# EAGLE design clock_arm_balanced (EAGLE 5.11)
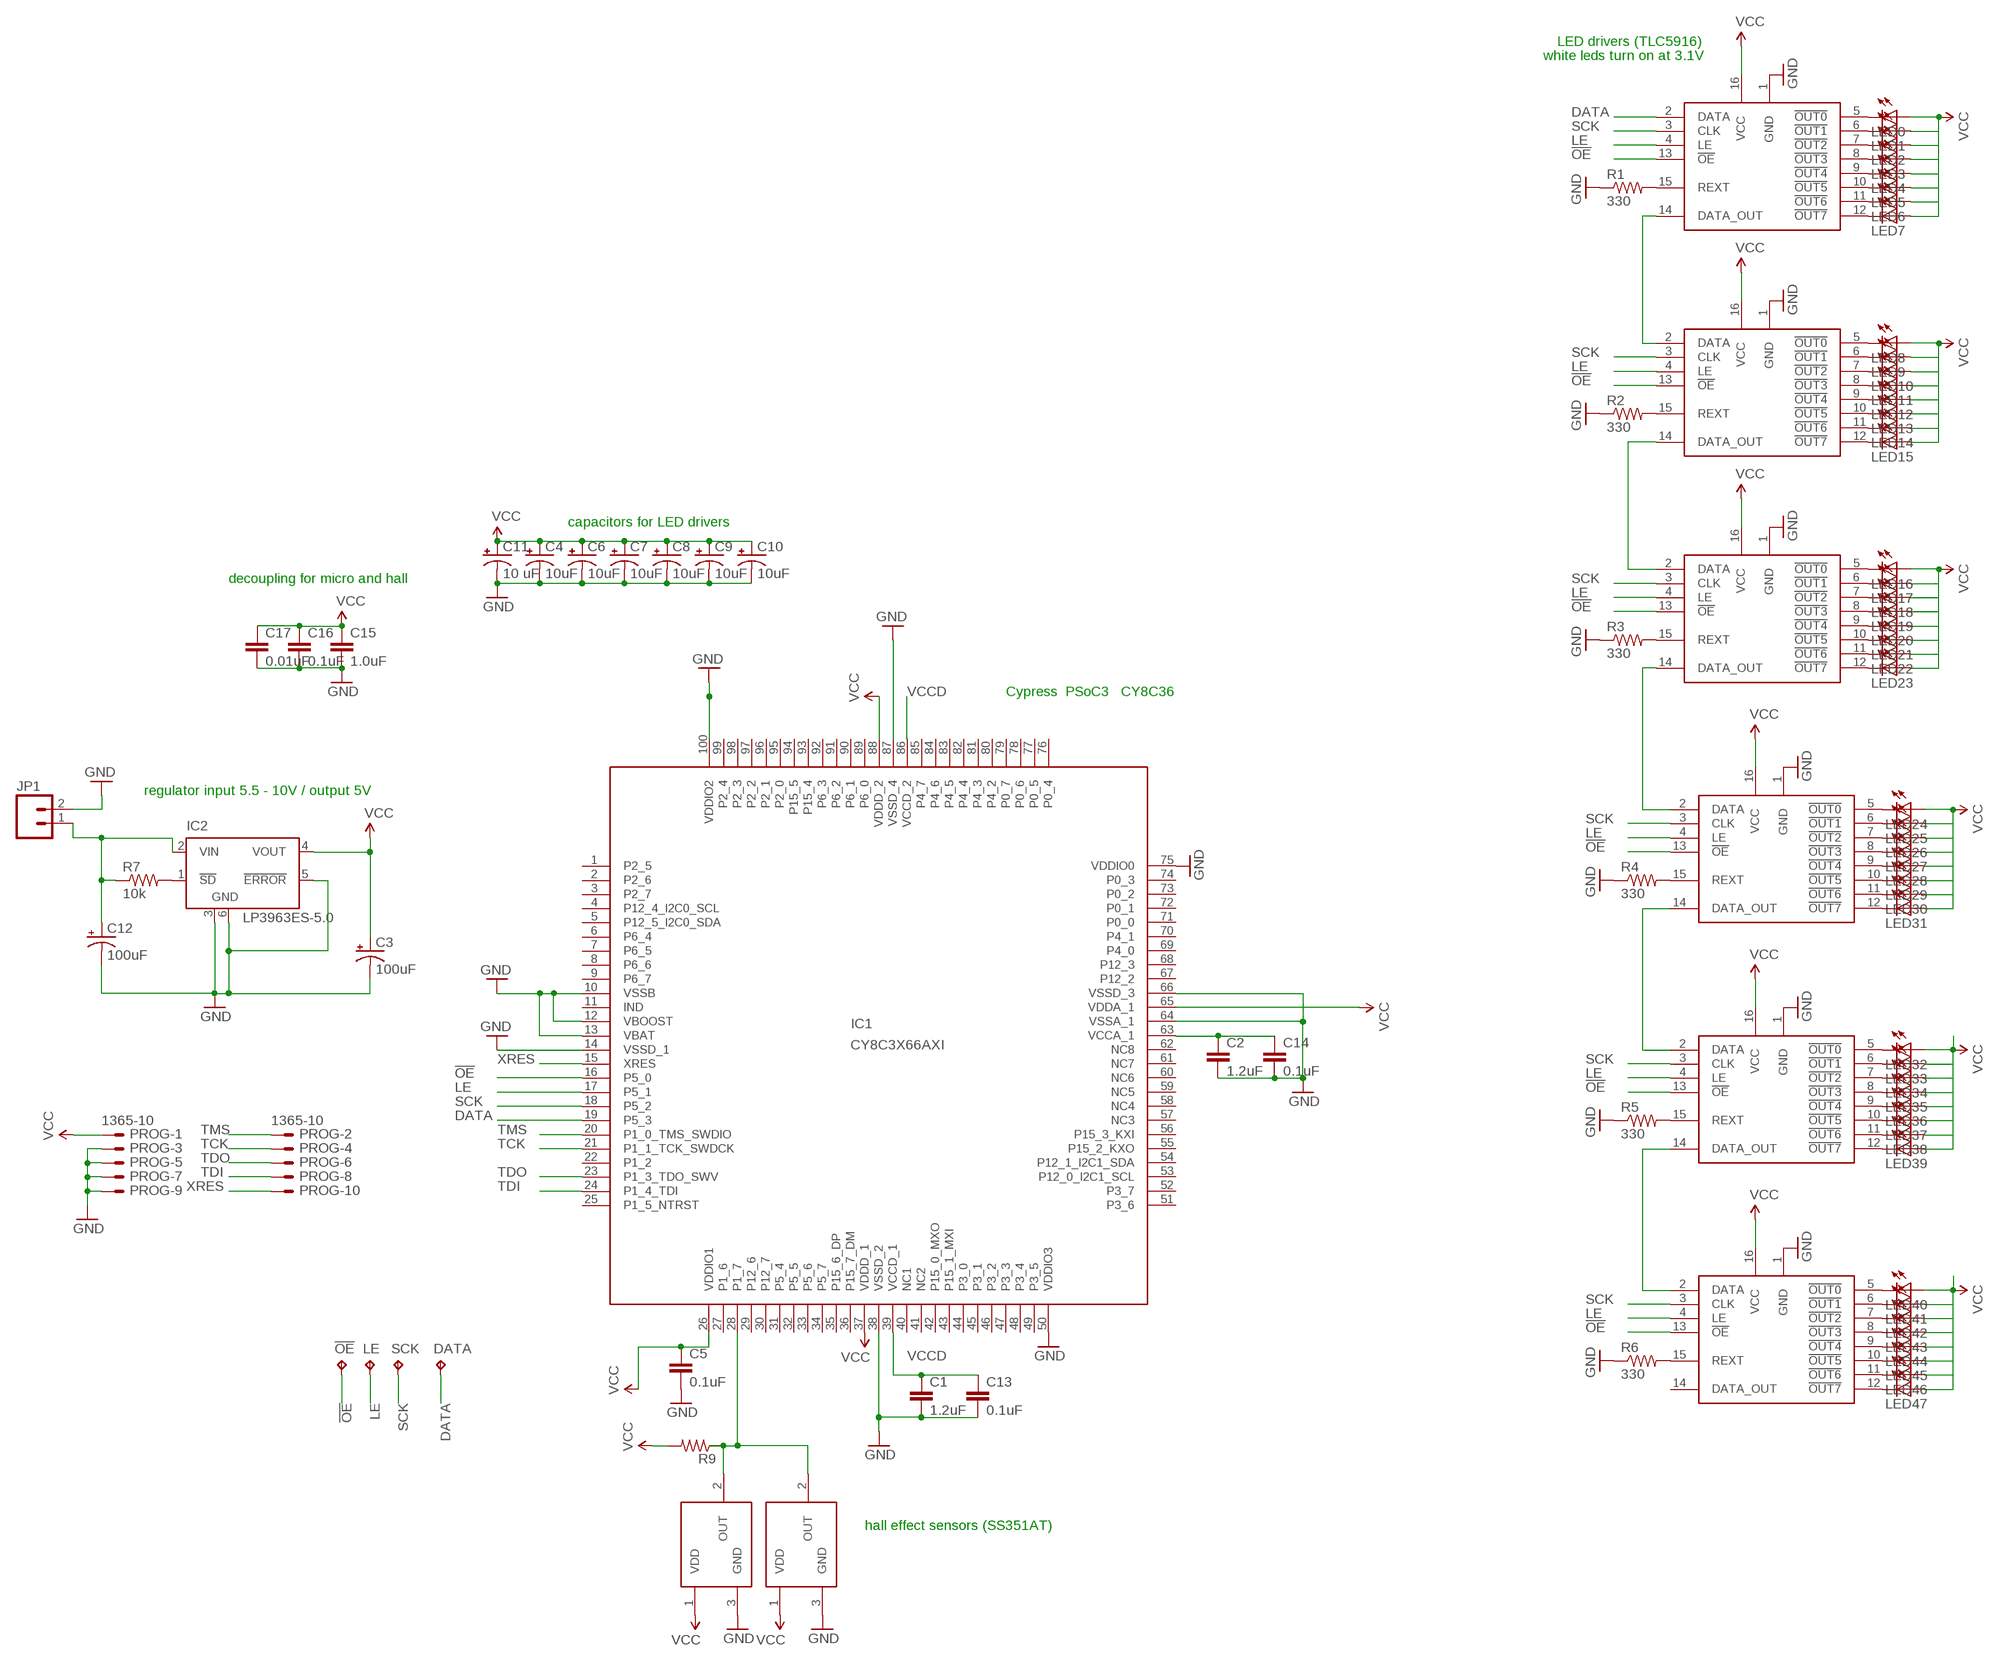
[diagram p0: schematic, sheet 1]

## Parts
!OE  TPTP12R  [TP12R]
C1  1.2uF  CAP0805  [0805]
C2  1.2uF  CAP0805  [0805]
C3  100uF  CAP_POL7343  [EIA7343]
C4  10uF  CAP_POL1206  [EIA3216]
C5  0.1uF  CAP0805  [0805]
C6  10uF  CAP_POL1206  [EIA3216]
C7  10uF  CAP_POL1206  [EIA3216]
C8  10uF  CAP_POL1206  [EIA3216]
C9  10uF  CAP_POL1206  [EIA3216]
C10  10uF  CAP_POL1206  [EIA3216]
C11  10 uF  CAP_POL1206  [EIA3216]
C12  100uF  CAP_POL7343  [EIA7343]
C13  0.1uF  CAP0805  [0805]
C14  0.1uF  CAP0805  [0805]
C15  1.0uF  CAP0805  [0805]
C16  0.1uF  CAP0805  [0805]
C17  0.01uF  CAP0805  [0805]
DATA  TPTP12R  [TP12R]
IC1  CY8C3X66AXI  [TQFP-100]
IC2  LP3963ES-5.0  [TO263-5]
JP1  M02PTH  [1X02]
LE  TPTP12R  [TP12R]
LED0  LG_T679-E1F1-1  [PLCC2]
LED1  LG_T679-E1F1-1  [PLCC2]
LED2  LG_T679-E1F1-1  [PLCC2]
LED3  LG_T679-E1F1-1  [PLCC2]
LED4  LG_T679-E1F1-1  [PLCC2]
LED5  LG_T679-E1F1-1  [PLCC2]
LED6  LG_T679-E1F1-1  [PLCC2]
LED7  LG_T679-E1F1-1  [PLCC2]
LED8  LG_T679-E1F1-1  [PLCC2]
LED9  LG_T679-E1F1-1  [PLCC2]
LED10  LG_T679-E1F1-1  [PLCC2]
LED11  LG_T679-E1F1-1  [PLCC2]
LED12  LG_T679-E1F1-1  [PLCC2]
LED13  LG_T679-E1F1-1  [PLCC2]
LED14  LG_T679-E1F1-1  [PLCC2]
LED15  LG_T679-E1F1-1  [PLCC2]
LED16  LG_T679-E1F1-1  [PLCC2]
LED17  LG_T679-E1F1-1  [PLCC2]
LED18  LG_T679-E1F1-1  [PLCC2]
LED19  LG_T679-E1F1-1  [PLCC2]
LED20  LG_T679-E1F1-1  [PLCC2]
LED21  LG_T679-E1F1-1  [PLCC2]
LED22  LG_T679-E1F1-1  [PLCC2]
LED23  LG_T679-E1F1-1  [PLCC2]
LED24  LG_T679-E1F1-1  [PLCC2]
LED25  LG_T679-E1F1-1  [PLCC2]
LED26  LG_T679-E1F1-1  [PLCC2]
LED27  LG_T679-E1F1-1  [PLCC2]
LED28  LG_T679-E1F1-1  [PLCC2]
LED29  LG_T679-E1F1-1  [PLCC2]
LED30  LG_T679-E1F1-1  [PLCC2]
LED31  LG_T679-E1F1-1  [PLCC2]
LED32  LG_T679-E1F1-1  [PLCC2]
LED33  LG_T679-E1F1-1  [PLCC2]
LED34  LG_T679-E1F1-1  [PLCC2]
LED35  LG_T679-E1F1-1  [PLCC2]
LED36  LG_T679-E1F1-1  [PLCC2]
LED37  LG_T679-E1F1-1  [PLCC2]
LED38  LG_T679-E1F1-1  [PLCC2]
LED39  LG_T679-E1F1-1  [PLCC2]
LED40  LG_T679-E1F1-1  [PLCC2]
LED41  LG_T679-E1F1-1  [PLCC2]
LED42  LG_T679-E1F1-1  [PLCC2]
LED43  LG_T679-E1F1-1  [PLCC2]
LED44  LG_T679-E1F1-1  [PLCC2]
LED45  LG_T679-E1F1-1  [PLCC2]
LED46  LG_T679-E1F1-1  [PLCC2]
LED47  LG_T679-E1F1-1  [PLCC2]
PROG  1365-10  [1365-10]
R1  330  RESISTOR0603-RES  [0603-RES]
R2  330  RESISTOR0603-RES  [0603-RES]
R3  330  RESISTOR0603-RES  [0603-RES]
R4  330  RESISTOR0603-RES  [0603-RES]
R5  330  RESISTOR0603-RES  [0603-RES]
R6  330  RESISTOR0603-RES  [0603-RES]
R7  10k  RESISTOR0603-RES  [0603-RES]
R9  RESISTOR0603-RES  [0603-RES]
SCK  TPTP12R  [TP12R]
U$1  TLC5916TSSOP  [TSSOP-16]
U$2  TLC5916TSSOP  [TSSOP-16]
U$3  TLC5916TSSOP  [TSSOP-16]
U$4  TLC5916TSSOP  [TSSOP-16]
U$5  TLC5916TSSOP  [TSSOP-16]
U$6  TLC5916TSSOP  [TSSOP-16]
U$7  SS351AT  [SOT23-3]
U$9  SS351AT  [SOT23-3]

## Nets
!OE: !OE.TP IC1.16(P5_0) U$1.13(!OE) U$2.13(!OE) U$3.13(!OE) U$4.13(!OE) U$5.13(!OE) U$6.13(!OE)
DATA: DATA.TP IC1.19(P5_3) U$1.2(DATA)
GND: C1.2 C2.2 C3.C(-) C4.C(-) C5.2 C6.C(-) C7.C(-) C8.C(-) C9.C(-) C10.C(-) C11.C(-) C12.C(-) C13.2 C14.2 C15.2 C16.2 C17.2 IC1.10(VSSB) IC1.12(VBOOST) IC1.13(VBAT) IC1.14(VSSD_1) IC1.38(VSSD_2) IC1.50(VDDIO3) IC1.64(VSSA_1) IC1.66(VSSD_3) IC1.75(VDDIO0) IC1.87(VSSD_4) IC1.100(VDDIO2) IC2.3(GND) IC2.5(!ERROR) IC2.6(GND) JP1.2 PROG.3 PROG.5 PROG.7 PROG.9 R1.1 R2.1 R3.1 R4.1 R5.1 R6.1 U$1.1(GND) U$2.1(GND) U$3.1(GND) U$4.1(GND) U$5.1(GND) U$6.1(GND) U$7.3(GND) U$9.3(GND)
LE: IC1.17(P5_1) LE.TP U$1.4(LE) U$2.4(LE) U$3.4(LE) U$4.4(LE) U$5.4(LE) U$6.4(LE)
N$1: LED0.C U$1.5(!OUT0)
N$2: LED1.C U$1.6(!OUT1)
N$3: LED2.C U$1.7(!OUT2)
N$4: LED3.C U$1.8(!OUT3)
N$5: LED4.C U$1.9(!OUT4)
N$6: LED5.C U$1.10(!OUT5)
N$7: LED6.C U$1.11(!OUT6)
N$8: LED7.C U$1.12(!OUT7)
N$9: R1.2 U$1.15(REXT)
N$10: LED8.C U$2.5(!OUT0)
N$11: LED9.C U$2.6(!OUT1)
N$12: LED10.C U$2.7(!OUT2)
N$13: LED11.C U$2.8(!OUT3)
N$14: LED12.C U$2.9(!OUT4)
N$15: LED13.C U$2.10(!OUT5)
N$16: LED14.C U$2.11(!OUT6)
N$17: LED15.C U$2.12(!OUT7)
N$18: R2.2 U$2.15(REXT)
N$19: LED16.C U$3.5(!OUT0)
N$20: LED17.C U$3.6(!OUT1)
N$21: LED18.C U$3.7(!OUT2)
N$22: LED19.C U$3.8(!OUT3)
N$23: LED20.C U$3.9(!OUT4)
N$24: LED21.C U$3.10(!OUT5)
N$25: LED22.C U$3.11(!OUT6)
N$26: LED23.C U$3.12(!OUT7)
N$27: R3.2 U$3.15(REXT)
N$28: LED24.C U$4.5(!OUT0)
N$29: LED25.C U$4.6(!OUT1)
N$30: LED26.C U$4.7(!OUT2)
N$31: LED27.C U$4.8(!OUT3)
N$32: LED28.C U$4.9(!OUT4)
N$33: LED29.C U$4.10(!OUT5)
N$34: LED30.C U$4.11(!OUT6)
N$35: LED31.C U$4.12(!OUT7)
N$36: R4.2 U$4.15(REXT)
N$37: U$1.14(DATA_OUT) U$2.2(DATA)
N$38: U$2.14(DATA_OUT) U$3.2(DATA)
N$39: U$3.14(DATA_OUT) U$4.2(DATA)
N$40: LED32.C U$5.5(!OUT0)
N$41: LED33.C U$5.6(!OUT1)
N$42: LED34.C U$5.7(!OUT2)
N$43: LED35.C U$5.8(!OUT3)
N$44: LED36.C U$5.9(!OUT4)
N$45: LED37.C U$5.10(!OUT5)
N$46: LED38.C U$5.11(!OUT6)
N$47: LED39.C U$5.12(!OUT7)
N$48: R5.2 U$5.15(REXT)
N$49: U$4.14(DATA_OUT) U$5.2(DATA)
N$50: LED40.C U$6.5(!OUT0)
N$51: LED41.C U$6.6(!OUT1)
N$52: LED42.C U$6.7(!OUT2)
N$53: LED43.C U$6.8(!OUT3)
N$54: LED44.C U$6.9(!OUT4)
N$55: LED45.C U$6.10(!OUT5)
N$56: LED46.C U$6.11(!OUT6)
N$57: LED47.C U$6.12(!OUT7)
N$58: R6.2 U$6.15(REXT)
N$59: U$5.14(DATA_OUT) U$6.2(DATA)
N$60: C12.A(+) IC2.2(VIN) JP1.1 R7.1
N$61: IC2.1(!SD) R7.2
N$80: C2.1 C14.1 IC1.63(VCCA_1)
N$81: IC1.28(P1_7) R9.1 U$7.2(OUT) U$9.2(OUT)
SCK: IC1.18(P5_2) SCK.TP U$1.3(CLK) U$2.3(CLK) U$3.3(CLK) U$4.3(CLK) U$5.3(CLK) U$6.3(CLK)
TCK: IC1.21(P1_1_TCK_SWDCK) PROG.4
TDI: IC1.24(P1_4_TDI) PROG.8
TDO: IC1.23(P1_3_TDO_SWV) PROG.6
TMS: IC1.20(P1_0_TMS_SWDIO) PROG.2
VCC: C3.A(+) C4.A(+) C5.1 C6.A(+) C7.A(+) C8.A(+) C9.A(+) C10.A(+) C11.A(+) C15.1 C16.1 C17.1 IC1.26(VDDIO1) IC1.37(VDDD_1) IC1.65(VDDA_1) IC1.88(VDDD_2) IC2.4(VOUT) LED0.A LED1.A LED2.A LED3.A LED4.A LED5.A LED6.A LED7.A LED8.A LED9.A LED10.A LED11.A LED12.A LED13.A LED14.A LED15.A LED16.A LED17.A LED18.A LED19.A LED20.A LED21.A LED22.A LED23.A LED24.A LED25.A LED26.A LED27.A LED28.A LED29.A LED30.A LED31.A LED32.A LED33.A LED34.A LED35.A LED36.A LED37.A LED38.A LED39.A LED40.A LED41.A LED42.A LED43.A LED44.A LED45.A LED46.A LED47.A PROG.1 R9.2 U$1.16(VCC) U$2.16(VCC) U$3.16(VCC) U$4.16(VCC) U$5.16(VCC) U$6.16(VCC) U$7.1(VDD) U$9.1(VDD)
VCCD: C1.1 C13.1 IC1.39(VCCD_1) IC1.86(VCCD_2)
XRES: IC1.15(XRES) PROG.10
Unconnected: IC1.1(P2_5) IC1.2(P2_6) IC1.3(P2_7) IC1.4(P12_4_I2C0_SCL) IC1.5(P12_5_I2C0_SDA) IC1.6(P6_4) IC1.7(P6_5) IC1.8(P6_6) IC1.9(P6_7) IC1.11(IND) IC1.22(P1_2) IC1.25(P1_5_NTRST) IC1.27(P1_6) IC1.29(P12_6) IC1.30(P12_7) IC1.31(P5_4) IC1.32(P5_5) IC1.33(P5_6) IC1.34(P5_7) IC1.35(P15_6_DP) IC1.36(P15_7_DM) IC1.40(NC1) IC1.41(NC2) IC1.42(P15_0_MXO) IC1.43(P15_1_MXI) IC1.44(P3_0) IC1.45(P3_1) IC1.46(P3_2) IC1.47(P3_3) IC1.48(P3_4) IC1.49(P3_5) IC1.51(P3_6) IC1.52(P3_7) IC1.53(P12_0_I2C1_SCL) IC1.54(P12_1_I2C1_SDA) IC1.55(P15_2_KXO) IC1.56(P15_3_KXI) IC1.57(NC3) IC1.58(NC4) IC1.59(NC5) IC1.60(NC6) IC1.61(NC7) IC1.62(NC8) IC1.67(P12_2) IC1.68(P12_3) IC1.69(P4_0) IC1.70(P4_1) IC1.71(P0_0) IC1.72(P0_1) IC1.73(P0_2) IC1.74(P0_3) IC1.76(P0_4) IC1.77(P0_5) IC1.78(P0_6) IC1.79(P0_7) IC1.80(P4_2) IC1.81(P4_3) IC1.82(P4_4) IC1.83(P4_5) IC1.84(P4_6) IC1.85(P4_7) IC1.89(P6_0) IC1.90(P6_1) IC1.91(P6_2) IC1.92(P6_3) IC1.93(P15_4) IC1.94(P15_5) IC1.95(P2_0) IC1.96(P2_1) IC1.97(P2_2) IC1.98(P2_3) IC1.99(P2_4) U$6.14(DATA_OUT)

## Notes on the sheet
- LED drivers (TLC5916)
- white leds turn on at 3.1V
- capacitors for LED drivers
- decoupling for micro and hall
- Cypress  PSoC3   CY8C36
- regulator input 5.5 - 10V / output 5V
- hall effect sensors (SS351AT)

## Library data of the parts
!OE DATA LE SCK = testpad:TP: Test pad
C1 C2 C5 C13-C17 = SparkFun:CAP: Capacitor Standard 0603 ceramic capacitor, and 0.1" leaded capacitor.
C3 C4 C6-C12 = SparkFun:CAP_POL: Capacitor Polarized These are standard SMD and PTH capacitors. Normally 10uF, 47uF, and 100uF in electrolytic and tantalum varieties. Always verify the external diameter of the through hole cap, it varies with capacity, voltage, and manufacturer. The EIA devices should be standard.
IC1 = PSoC3:CY8C3X66AXI: CY8C_pins edit this description Auto generated by make-symbol-device-package-bsdl.ulp Rev. 34 Source: CY8C_pins.txt
IC2 = linear:LP3963?*: 3A Fast Ultra Low Dropout Linear Regulator Source: http://cache.national.com/ds/LP/LP3963.pdf
JP1 = SparkFun:M02: Header 2 Standard 2-pin 0.1" header. Use with straight break away headers (SKU : PRT-00116), right angle break away headers (PRT-00553), swiss pins (PRT-00743), machine pins (PRT-00117), and female headers (PRT-00115). Molex polarized connector foot print use with SKU : PRT-08233 with associated crimp pins and housings.
LED0 LED1-LED47 = led:*_T679-?-1: LC TOPLED® Low Current LED Source: http://catalog.osram-os.com .. LG_LS_LY_T679_OBS.pdf; COLOR: green
PROG = con-leotronics:1365-10: DUAL ROW STRAIGHT HEADER 1364 SERIES. 1.27mm x 1.27mm. Without Fixing Post. SMT Source: http://www.leotronics.co.uk/Conexcon/Data%20Sheets/sec.%20A/1364ing.pdf; OC_FARNELL: unknown; OC_NEWARK: unknown
R1-R7 R9 = SparkFun:RESISTOR: Resistor Basic schematic elements and footprints for 0603, 1206, and PTH resistors.
U$1-U$6 = SparkFun:TLC5916
U$7 U$9 = SparkFun:SS351AT

## Board
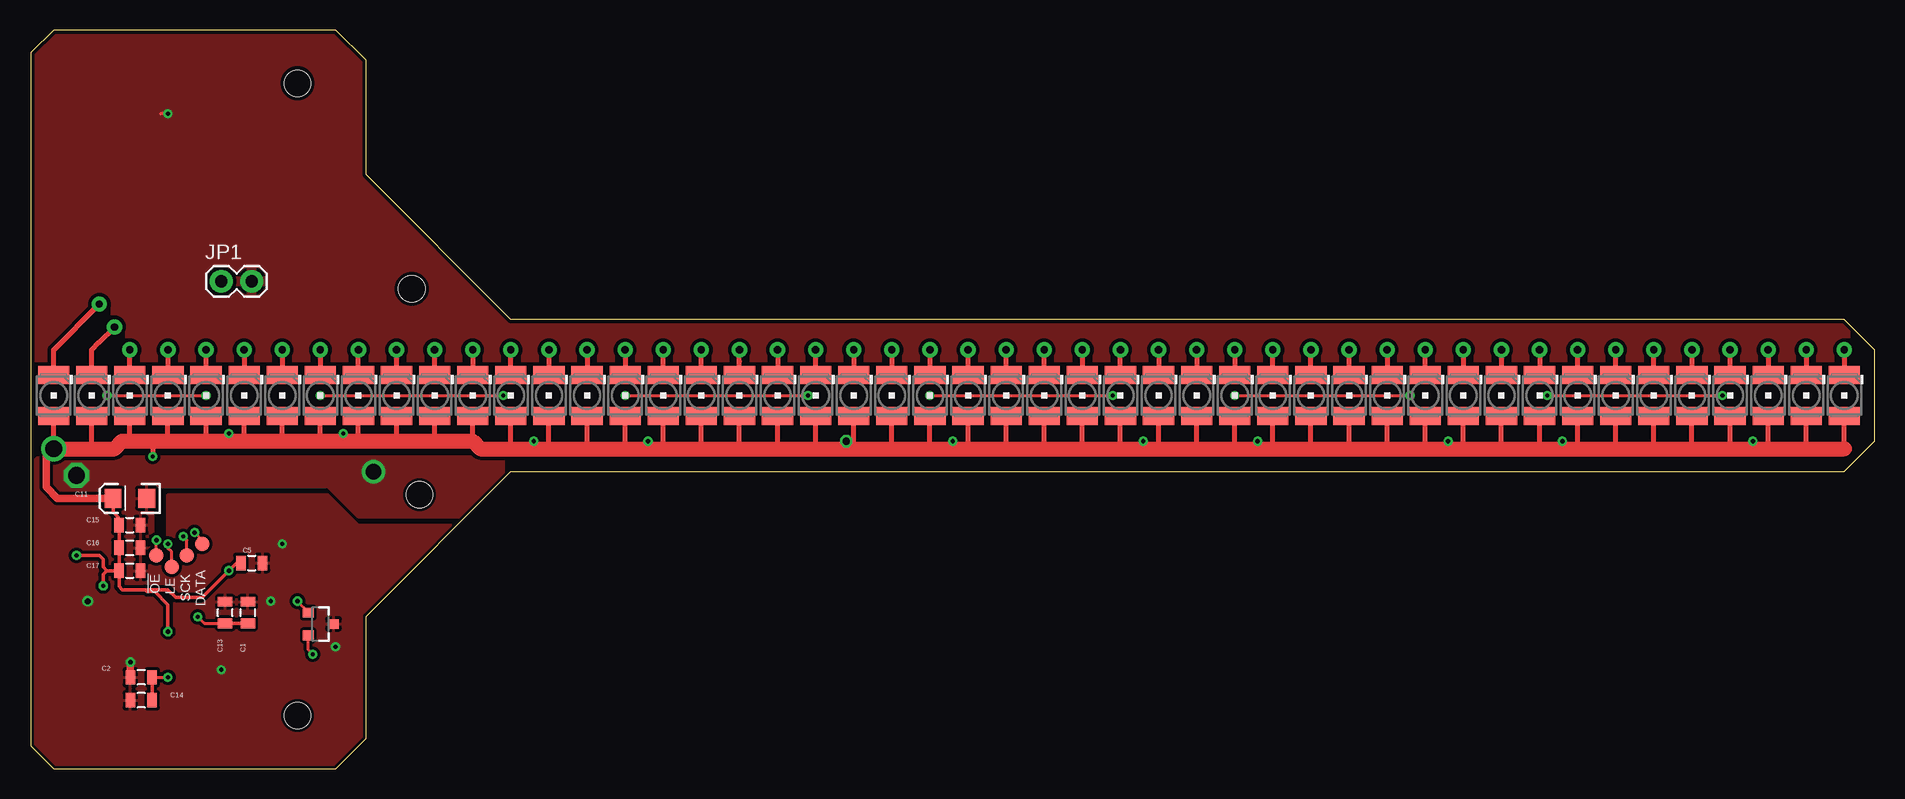
[diagram p1: board, top side]
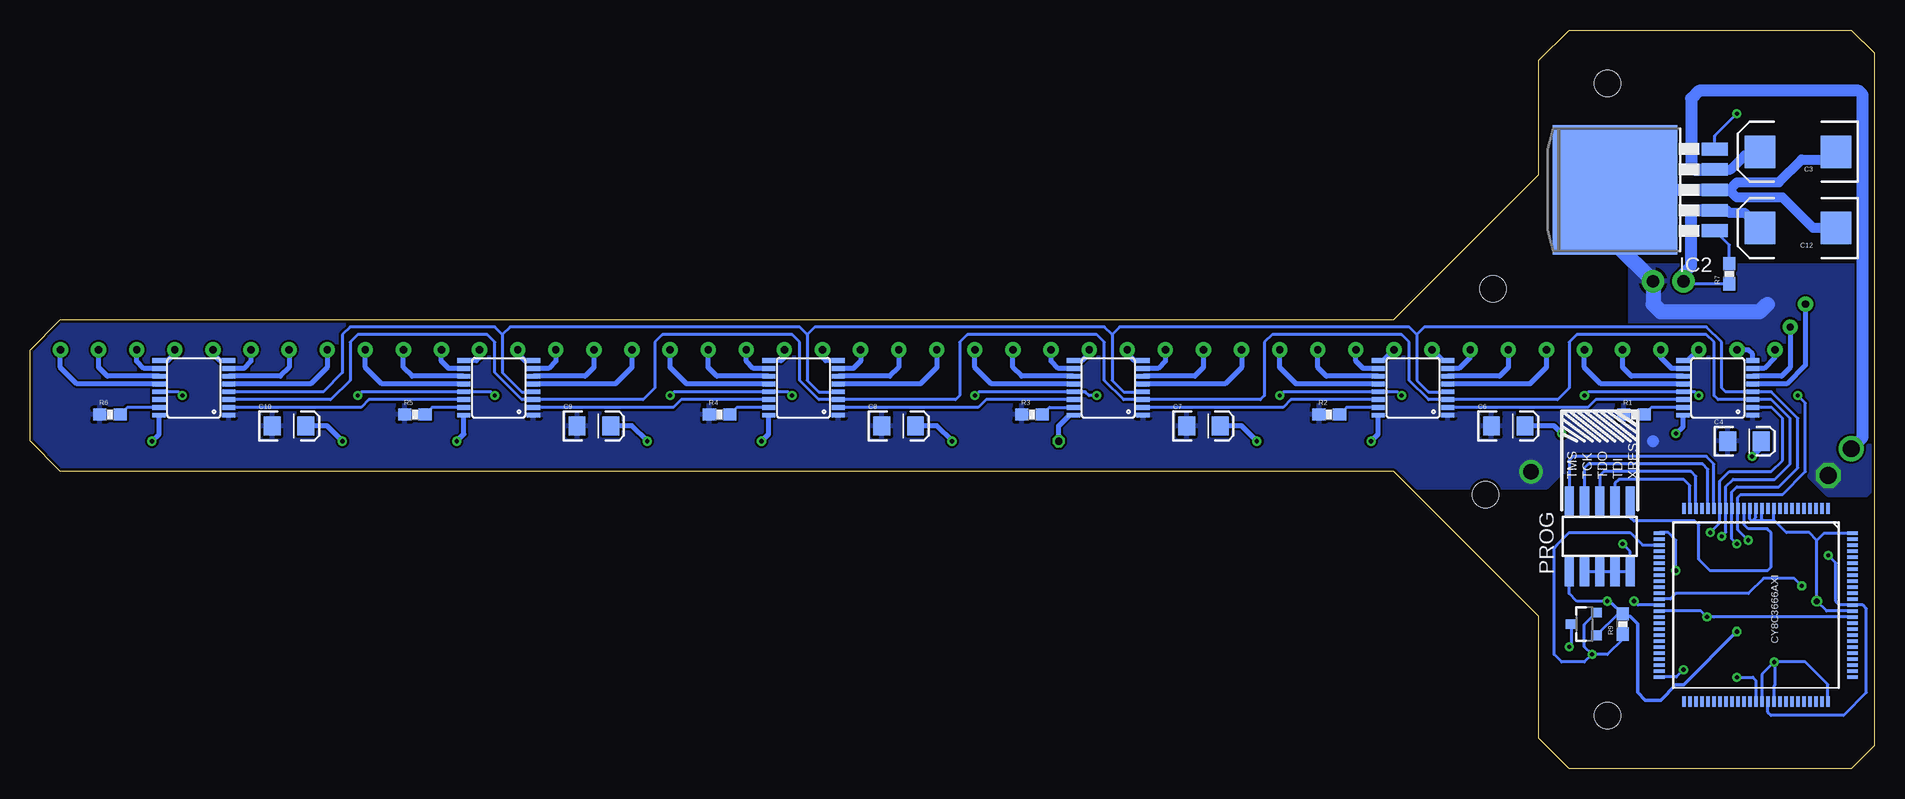
[diagram p2: board, bottom side, seen from below]

Size 153.67 x 61.59 mm. Coordinates in mm from the lower left corner, seen from the top.
Outline: 0,1.9 1.9,0 25.4,0 27.94,2.54 27.94,12.7 40.01,24.76 151.13,24.76 153.67,27.3 153.67,34.92 151.14,37.45 151.11,37.45 40.01,37.46 27.94,49.53 27.94,59.05 25.4,61.59 1.9,61.59 0,59.69 0,1.9
Copper layers (1*16): Top 0.0356mm / dielectric 1.5011mm / Bottom 0.0356mm
Design rules "SilverCircuits *": minimum track width 7mil, minimum drill 14mil, track to track 7mil, track to pad 7mil, pad to pad 7mil, via to via 7mil, smd to smd 0mil, copper to edge 10mil, drill to drill 8mil, minimum pad ring 10mil, minimum via ring 8mil, stop-mask expansion 4mil, vias tented up to drill 0mil, thermal gap 10mil
Holes 2.2 mm at 22.23,57.15 22.23,4.44 31.75,40 32.38,22.86

### Footprints (pad centres in the part's own frame; a part is rotated, then mirrored left to right if it is on the bottom)
TP12R = smd 1.2 x 1.2: TP 0,0
0805 = smd 0.8 x 1.2: 1 -0.9,0; 2 0.9,0
EIA7343 = smd 2.55 x 2.7: A 3.17,0; C -3.17,0
EIA3216 = smd 1.4 x 1.6: A 1.4,0; C -1.4,0
TQFP-100 = smd 0.9 x 0.3: 1 -8.05,6; 2 -8.05,5.5; 3 -8.05,5; 4 -8.05,4.5; 5 -8.05,4; 6 -8.05,3.5; 7 -8.05,3; 8 -8.05,2.5; 9 -8.05,2; 10 -8.05,1.5; 11 -8.05,1; 12 -8.05,0.5; 13 -8.05,0; 14 -8.05,-0.5; 15 -8.05,-1; 16 -8.05,-1.5; 17 -8.05,-2; 18 -8.05,-2.5; 19 -8.05,-3; 20 -8.05,-3.5; 21 -8.05,-4; 22 -8.05,-4.5; 23 -8.05,-5; 24 -8.05,-5.5; 25 -8.05,-6; 51 8.05,-6; 52 8.05,-5.5; 53 8.05,-5; 54 8.05,-4.5; 55 8.05,-4; 56 8.05,-3.5; 57 8.05,-3; 58 8.05,-2.5; 59 8.05,-2; 60 8.05,-1.5; 61 8.05,-1; 62 8.05,-0.5; 63 8.05,0; 64 8.05,0.5; 65 8.05,1; 66 8.05,1.5; 67 8.05,2; 68 8.05,2.5; 69 8.05,3; 70 8.05,3.5; 71 8.05,4; 72 8.05,4.5; 73 8.05,5; 74 8.05,5.5; 75 8.05,6 | smd 0.3 x 0.9: 26 -6,-8.05; 27 -5.5,-8.05; 28 -5,-8.05; 29 -4.5,-8.05; 30 -4,-8.05; 31 -3.5,-8.05; 32 -3,-8.05; 33 -2.5,-8.05; 34 -2,-8.05; 35 -1.5,-8.05; 36 -1,-8.05; 37 -0.5,-8.05; 38 0,-8.05; 39 0.5,-8.05; 40 1,-8.05; 41 1.5,-8.05; 42 2,-8.05; 43 2.5,-8.05; 44 3,-8.05; 45 3.5,-8.05; 46 4,-8.05; 47 4.5,-8.05; 48 5,-8.05; 49 5.5,-8.05; 50 6,-8.05; 76 6,8.05; 77 5.5,8.05; 78 5,8.05; 79 4.5,8.05; 80 4,8.05; 81 3.5,8.05; 82 3,8.05; 83 2.5,8.05; 84 2,8.05; 85 1.5,8.05; 86 1,8.05; 87 0.5,8.05; 88 0,8.05; 89 -0.5,8.05; 90 -1,8.05; 91 -1.5,8.05; 92 -2,8.05; 93 -2.5,8.05; 94 -3,8.05; 95 -3.5,8.05; 96 -4,8.05; 97 -4.5,8.05; 98 -5,8.05; 99 -5.5,8.05; 100 -6,8.05
TO263-5 = smd 1.067 x 2.159: 1 -3.404,-5.791; 2 -1.702,-5.791; 3 0,-5.791; 4 1.702,-5.791; 5 3.404,-5.791 | smd 10.8 x 10.41: 6 0,2.54
1X02 = drill 1.016 pad 1.88 round: 1 0,0; 2 2.54,0
PLCC2 = smd 2.6 x 1.5: A 0,1.7; C 0,-1.7
1365-10 = smd 0.76 x 2.4: 1 -2.54,-2.95; 2 -2.54,2.95; 3 -1.27,-2.95; 4 -1.27,2.95; 5 0,-2.95; 6 0,2.95; 7 1.27,-2.95; 8 1.27,2.95; 9 2.54,-2.95; 10 2.54,2.95
0603-RES = smd 1.1 x 1: 1 -0.85,0; 2 0.85,0
TSSOP-16 = smd 0.4 x 1.1: 1 -2.275,-2.9; 2 -1.625,-2.9; 3 -0.975,-2.9; 4 -0.325,-2.9; 5 0.325,-2.9; 6 0.975,-2.9; 7 1.625,-2.9; 8 2.275,-2.9; 9 2.275,2.9; 10 1.625,2.9; 11 0.975,2.9; 12 0.325,2.9; 13 -0.325,2.9; 14 -0.975,2.9; 15 -1.625,2.9; 16 -2.275,2.9
SOT23-3 = smd 0.8 x 0.9: 1 -0.95,-1; 2 0.95,-1; 3 0,1.1

### Placement (x,y rotation side)
!OE  10.48,17.78 180 top
C1  16.19,13.02 90 top
C2  9.21,7.62 180 top
C3  6.35,51.44 180 bottom
C4  10.8,27.3 0 bottom
C5  18.41,17.14 0 top
C6  30.48,28.57 0 bottom
C7  55.88,28.57 0 bottom
C8  81.28,28.57 0 bottom
C9  106.68,28.57 0 bottom
C10  132.08,28.57 0 bottom
C11  8.26,22.54 180 top
C12  6.35,45.08 180 bottom
C13  18.1,13.02 90 top
C14  9.21,5.71 180 top
C15  8.26,20.32 0 top
C16  8.26,18.41 0 top
C17  8.26,16.51 0 top
DATA  14.29,18.73 180 top
IC1  9.84,13.65 270 bottom
IC2  19.05,48.26 90 bottom
JP1  15.88,40.64 0 top
LE  11.75,16.83 180 top
LED0  1.9,31.11 180 top
LED1  5.08,31.11 180 top
LED2  8.26,31.11 180 top
LED3  11.43,31.11 180 top
LED4  14.6,31.11 180 top
LED5  17.78,31.11 180 top
LED6  20.95,31.11 180 top
LED7  24.13,31.11 180 top
LED8  27.3,31.11 180 top
LED9  30.48,31.11 180 top
LED10  33.66,31.11 180 top
LED11  36.83,31.11 180 top
LED12  40.01,31.11 180 top
LED13  43.18,31.11 180 top
LED14  46.35,31.11 180 top
LED15  49.53,31.11 180 top
LED16  52.71,31.11 180 top
LED17  55.88,31.11 180 top
LED18  59.05,31.11 180 top
LED19  62.23,31.11 180 top
LED20  65.41,31.11 180 top
LED21  68.58,31.11 180 top
LED22  71.75,31.11 180 top
LED23  74.93,31.11 180 top
LED24  78.1,31.11 180 top
LED25  81.28,31.11 180 top
LED26  84.46,31.11 180 top
LED27  87.63,31.11 180 top
LED28  90.81,31.11 180 top
LED29  93.98,31.11 180 top
LED30  97.16,31.11 180 top
LED31  100.33,31.11 180 top
LED32  103.5,31.11 180 top
LED33  106.68,31.11 180 top
LED34  109.85,31.11 180 top
LED35  113.03,31.11 180 top
LED36  116.2,31.11 180 top
LED37  119.38,31.11 180 top
LED38  122.55,31.11 180 top
LED39  125.73,31.11 180 top
LED40  128.91,31.11 180 top
LED41  132.08,31.11 180 top
LED42  135.25,31.11 180 top
LED43  138.43,31.11 180 top
LED44  141.6,31.11 180 top
LED45  144.78,31.11 180 top
LED46  147.95,31.11 180 top
LED47  151.13,31.11 180 top
PROG  22.86,19.37 0 bottom
R1  20,29.53 0 bottom
R2  45.4,29.53 0 bottom
R3  70.17,29.53 0 bottom
R4  96.2,29.53 0 bottom
R5  121.6,29.53 0 bottom
R6  147,29.53 0 bottom
R7  12.06,41.27 90 bottom
R9  20.95,12.06 90 bottom
SCK  13.02,17.78 180 top
U$1  13.02,31.75 90 bottom
U$2  38.42,31.75 90 bottom
U$3  63.82,31.75 90 bottom
U$4  89.22,31.75 90 bottom
U$5  114.62,31.75 90 bottom
U$6  140.02,31.75 90 bottom
U$7  24.13,12.06 270 top
U$9  24.13,12.06 90 bottom

### Tracks (layer width: path | path; a pad name or v marks a point on that pad's centre or on a via)
!OE  (via drill 0.36)
  Top 0.254: v24.13,31.11 v39.37,31.11 | v49.53,31.11 v64.77,31.11 | v6.35,31.11 v14.6,31.11 | v74.93,31.11 v90.17,31.11 | v100.33,31.11 v114.94,31.11 | v126.36,31.11 v140.97,31.11 | !OE.TP v10.48,19.05
  Bottom 0.254: v24.13,31.11 23.8,31.42 U$1.13 14.93,31.42 v14.6,31.11 | v39.37,31.11 39.7,31.42 U$2.13 49.21,31.42 v49.53,31.11 | v64.77,31.11 65.41,31.11 65.73,31.42 U$3.13 74.6,31.42 v74.93,31.11 | v6.35,31.11 5.71,30.48 5.71,24.76 7.62,22.86 11.11,22.86 11.34,22.63 IC1.16 11.34,19.91 v10.48,19.05 | v90.17,31.11 90.5,31.42 U$4.13 100,31.42 v100.33,31.11 | v114.94,31.11 115.26,31.42 U$5.13 126.04,31.42 v126.36,31.11 | U$6.13 141.29,31.42 v140.97,31.11
DATA  (via drill 0.36)
  Top 0.254: v13.65,19.68 14.29,19.05 DATA.TP
  Bottom 0.254: U$1.2 8.53,30.12 7.62,29.21 7.62,25.72 8.57,24.76 12.06,24.76 12.84,23.99 IC1.19 12.84,20.49 v13.65,19.68
GND  (via drill 0.36, 0.5, 1.3, 1.4)
  Top 0.254: v11.43,54.61 10.8,54.61
  Top 0.61: v8.31,8.89 C2.2
  Bottom 0.254: v8.31,8.89 8.26,8.84 8.26,6.98 8.34,6.9 IC1.66 | IC1.100 4.16,19.65 4.76,19.05 | IC1.87 3.95,13.15 v4.76,13.97 4.76,19.05 | IC1.64 9.34,7.85 v8.31,8.89 | IC1.75 3.84,7.02 5.71,8.89 v8.31,8.89 | IC1.50 16.48,7.65 v15.88,8.25 | U$7.3 25.23,10.33 v25.4,10.16 | PROG.3 PROG.5 PROG.7 PROG.9 20.32,18.1 v20.95,18.73 | 8.34,20.72 IC1.10 | 8.34,20.72 7.3,19.68 5.4,19.68 4.76,19.05 | IC1.14 10.34,20.82 10.16,20.64 | 9.52,20.64 8.43,20.64 8.34,20.72 | 9.52,20.64 10.16,20.64 | IC1.12 9.34,20.82 9.52,20.64 | IC1.13 9.84,20.95 10.16,20.64 | IC2.5 13.26,52.78 v11.43,54.61 | IC1.38 19.69,13.65 v20,13.97
  Bottom 0.813: 12.06,48.26 IC2.3 | 12.06,48.26 11.43,48.89 7.94,48.89 6.03,50.8 3.81,50.8 C3.C | C12.C 5.08,45.08 7.62,47.62 11.43,47.62 12.06,48.26
  Bottom 1.016: 18.41,27.3 18.42,27.3 | IC2.3 IC2.6 21.59,43.81
  Bottom 1.27: 21.59,43.81 JP1.2 18.41,38.73 17.78,38.1 9.52,38.1 8.89,38.73
  other vias: 28.57,24.76 3.81,24.45
  pour Bottom: 0,23.49 0,41.91 20.32,41.91 20.32,36.83 153.35,37.15 153.67,36.83 153.67,25.4 153.35,24.76 39.37,24.76 38.1,23.49 27.3,23.49 26.03,24.76 5.71,24.76 3.81,22.86 0.63,22.86
  pour Top (isolate 0.305): 0,33.66 0,59.69 1.9,61.59 25.4,61.59 27.94,59.05 27.94,49.53 40.01,37.46 153.67,37.46 153.67,33.66
  pour Top (isolate 0.254): 0,0 0,25.4 0.63,26.03 39.37,26.03 39.37,24.13 36.2,20.95 27.3,20.95 24.77,23.49 10.16,23.49 10.16,19.05 11.43,19.05 11.43,22.86 24.77,22.86 27.3,20.32 35.56,20.32 27.94,12.7 27.94,2.54 25.4,0
LE  (via drill 0.36)
  Top 0.254: v11.43,18.73 11.43,18.41 11.75,18.1 LE.TP
  Bottom 0.254: U$2.4 37.14,31.42 38.1,32.38 38.1,36.2 | 38.1,36.2 38.73,36.83 62.87,36.83 63.5,36.2 | U$3.4 62.54,31.42 63.5,32.38 63.5,36.2 | 63.5,36.2 64.13,36.83 88.26,36.83 88.9,36.2 | U$4.4 87.94,31.42 88.9,32.38 88.9,36.2 | 88.9,36.2 89.53,36.83 113.66,36.83 114.3,36.2 | U$5.4 112.7,31.42 114.3,33.02 114.3,36.2 | 114.3,36.2 114.94,36.83 127,36.83 127.63,36.2 127.63,33.02 129.23,31.42 U$6.4 | 38.1,36.2 37.46,36.83 13.97,36.83 12.7,35.56 12.7,31.75 12.38,31.42 U$1.4 8.56,31.42 6.35,29.21 6.35,25.08 7.94,23.49 11.43,23.49 11.84,23.08 IC1.17 11.84,19.14 v11.43,18.73
N$1  (via drill 0.61 pad 1.27)
  Top 0.406: LED0.C 1.9,34.92 v5.71,38.73
  Bottom 0.406: v5.71,38.73 5.71,33.66 7.3,32.07 U$1.5
N$2  (via drill 0.61 pad 1.27)
  Top 0.406: LED1.C 5.08,34.92 5.71,35.56 v6.98,36.83
  Bottom 0.406: U$1.6 7.71,32.73 6.98,33.45 v6.98,36.83
N$3  (via drill 0.61 pad 1.27)
  Top 0.406: LED2.C v8.26,34.92
  Bottom 0.406: U$1.7 9.17,33.38 8.26,34.29 v8.26,34.92
N$4  (via drill 0.61 pad 1.27)
  Top 0.406: v11.43,34.92 LED3.C
  Bottom 0.406: U$1.8 10.12,34.56 10.48,34.92 v11.43,34.92
N$5  (via drill 0.61 pad 1.27)
  Top 0.406: LED4.C v14.6,34.92
  Bottom 0.406: U$1.9 15.51,34.02 v14.6,34.92
N$6  (via drill 0.61 pad 1.27)
  Top 0.406: v17.78,34.92 LED5.C
  Bottom 0.406: U$1.10 16.87,33.38 17.78,34.29 v17.78,34.92
N$7  (via drill 0.61 pad 1.27)
  Top 0.406: v20.95,34.92 LED6.C
  Bottom 0.406: U$1.11 20.23,32.73 20.95,33.45 v20.95,34.92
N$8  (via drill 0.61 pad 1.27)
  Top 0.406: v24.13,34.92 LED7.C
  Bottom 0.406: U$1.12 22.76,32.07 24.13,33.45 v24.13,34.92
N$9
  Bottom 0.254: U$1.15 18.55,30.12 R1.2
N$10  (via drill 0.61 pad 1.27)
  Top 0.406: LED8.C v27.3,34.92
  Bottom 0.406: U$2.5 28.68,32.07 27.3,33.45 v27.3,34.92
N$11  (via drill 0.61 pad 1.27)
  Top 0.406: LED9.C v30.48,34.92
  Bottom 0.406: U$2.6 31.2,32.73 30.48,33.45 v30.48,34.92
N$12  (via drill 0.61 pad 1.27)
  Top 0.406: LED10.C v33.66,34.92
  Bottom 0.406: U$2.7 34.57,33.38 33.66,34.29 v33.66,34.92
N$13  (via drill 0.61 pad 1.27)
  Top 0.406: v36.83,34.92 LED11.C
  Bottom 0.406: U$2.8 35.93,34.02 v36.83,34.92
N$14  (via drill 0.61 pad 1.27)
  Top 0.406: LED12.C v40.01,34.92
  Bottom 0.406: U$2.9 40.9,34.02 v40.01,34.92
N$15  (via drill 0.61 pad 1.27)
  Top 0.406: v43.18,34.92 LED13.C
  Bottom 0.406: U$2.10 42.58,33.38 43.18,33.97 v43.18,34.92
N$16  (via drill 0.61 pad 1.27)
  Top 0.406: v46.35,34.92 LED14.C
  Bottom 0.406: U$2.11 45.63,32.73 46.35,33.45 v46.35,34.92
N$17  (via drill 0.61 pad 1.27)
  Top 0.406: v49.53,34.92 LED15.C
  Bottom 0.406: U$2.12 48.15,32.07 49.53,33.45 v49.53,34.92
N$18
  Bottom 0.254: U$2.15 43.96,30.12 R2.2
N$19  (via drill 0.61 pad 1.27)
  Top 0.406: LED16.C v52.71,34.92
  Bottom 0.406: U$3.5 54.08,32.07 52.71,33.45 v52.71,34.92
N$20  (via drill 0.61 pad 1.27)
  Top 0.406: LED17.C v55.88,34.92
  Bottom 0.406: U$3.6 56.6,32.73 55.88,33.45 v55.88,34.92
N$21  (via drill 0.61 pad 1.27)
  Top 0.406: 59.05,33.97 LED18.C v59.05,34.92
  Bottom 0.406: U$3.7 59.65,33.38 59.05,33.97 v59.05,34.92
N$22  (via drill 0.61 pad 1.27)
  Top 0.406: v62.23,34.92 LED19.C
  Bottom 0.406: U$3.8 61.65,34.02 62.23,34.61 v62.23,34.92
N$23  (via drill 0.61 pad 1.27)
  Top 0.406: LED20.C v65.41,34.92
  Bottom 0.406: U$3.9 65.99,34.02 65.41,34.61 v65.41,34.92
N$24  (via drill 0.61 pad 1.27)
  Top 0.406: v68.58,34.92 LED21.C
  Bottom 0.406: U$3.10 67.98,33.38 68.58,33.97 v68.58,34.92
N$25  (via drill 0.61 pad 1.27)
  Top 0.406: v71.75,34.92 LED22.C
  Bottom 0.406: U$3.11 71.03,32.73 71.75,33.45 v71.75,34.92
N$26  (via drill 0.61 pad 1.27)
  Top 0.406: v74.93,34.92 LED23.C
  Bottom 0.406: U$3.12 73.56,32.07 74.93,33.45 v74.93,34.92
N$27
  Bottom 0.254: U$3.15 68.72,30.12 R3.2
N$28  (via drill 0.61 pad 1.27)
  Top 0.406: LED24.C v78.1,34.92
  Bottom 0.406: U$4.5 79.48,32.07 78.1,33.45 v78.1,34.92
N$29  (via drill 0.61 pad 1.27)
  Top 0.406: LED25.C v81.28,34.92
  Bottom 0.406: U$4.6 82,32.73 81.28,33.45 v81.28,34.92
N$30  (via drill 0.61 pad 1.27)
  Top 0.406: LED26.C v84.46,34.92
  Bottom 0.406: U$4.7 85.05,33.38 84.46,33.97 v84.46,34.92
N$31  (via drill 0.61 pad 1.27)
  Top 0.406: v87.63,34.92 LED27.C
  Bottom 0.406: U$4.8 87.37,34.02 87.63,34.29 v87.63,34.92
N$32  (via drill 0.61 pad 1.27)
  Top 0.406: LED28.C v90.81,34.92
  Bottom 0.406: U$4.9 91.07,34.02 90.81,34.29 v90.81,34.92
N$33  (via drill 0.61 pad 1.27)
  Top 0.406: v93.98,34.92 LED29.C
  Bottom 0.406: U$4.10 93.38,33.38 93.98,33.97 v93.98,34.92
N$34  (via drill 0.61 pad 1.27)
  Top 0.406: v97.16,34.92 LED30.C
  Bottom 0.406: U$4.11 96.43,32.73 97.16,33.45 v97.16,34.92
N$35  (via drill 0.61 pad 1.27)
  Top 0.406: v100.33,34.92 LED31.C
  Bottom 0.406: U$4.12 98.95,32.07 100.33,33.45 v100.33,34.92
N$36
  Bottom 0.254: U$4.15 94.75,30.12 R4.2
N$37
  Bottom 0.254: U$1.14 23.2,30.77 23.85,30.12 U$2.2
N$38
  Bottom 0.254: U$2.14 48.6,30.77 49.25,30.12 U$3.2
N$39
  Bottom 0.254: U$3.14 74,30.77 74.65,30.12 U$4.2
N$40  (via drill 0.61 pad 1.27)
  Top 0.406: LED32.C v103.5,34.92
  Bottom 0.406: U$5.5 104.88,32.07 103.5,33.45 v103.5,34.92
N$41  (via drill 0.61 pad 1.27)
  Top 0.406: LED33.C v106.68,34.92
  Bottom 0.406: U$5.6 107.41,32.73 106.68,33.45 v106.68,34.92
N$42  (via drill 0.61 pad 1.27)
  Top 0.406: LED34.C v109.85,34.92
  Bottom 0.406: U$5.7 110.45,33.38 109.85,33.97 v109.85,34.92
N$43  (via drill 0.61 pad 1.27)
  Top 0.406: v113.03,34.92 LED35.C
  Bottom 0.406: U$5.8 112.45,34.02 113.03,34.61 v113.03,34.92
N$44  (via drill 0.61 pad 1.27)
  Top 0.406: LED36.C v116.2,34.92
  Bottom 0.406: U$5.9 116.47,34.02 116.2,34.29 v116.2,34.92
N$45  (via drill 0.61 pad 1.27)
  Top 0.406: v119.38,34.92 LED37.C
  Bottom 0.406: U$5.10 118.78,33.38 119.38,33.97 v119.38,34.92
N$46  (via drill 0.61 pad 1.27)
  Top 0.406: v122.55,34.92 LED38.C
  Bottom 0.406: U$5.11 121.83,32.73 122.55,33.45 v122.55,34.92
N$47  (via drill 0.61 pad 1.27)
  Top 0.406: v125.73,34.92 LED39.C
  Bottom 0.406: U$5.12 124.35,32.07 125.73,33.45 v125.73,34.92
N$48
  Bottom 0.254: U$5.15 120.16,30.12 R5.2
N$49
  Bottom 0.254: U$4.14 99.4,30.77 100.05,30.12 U$5.2
N$50  (via drill 0.61 pad 1.27)
  Top 0.406: LED40.C v128.91,34.92
  Bottom 0.406: U$6.5 130.28,32.07 128.91,33.45 v128.91,34.92
N$51  (via drill 0.61 pad 1.27)
  Top 0.406: LED41.C v132.08,34.92
  Bottom 0.406: U$6.6 132.8,32.73 132.08,33.45 v132.08,34.92
N$52  (via drill 0.61 pad 1.27)
  Top 0.406: LED42.C v135.25,34.92
  Bottom 0.406: U$6.7 135.85,33.38 135.25,33.97 v135.25,34.92
N$53  (via drill 0.61 pad 1.27)
  Top 0.406: v138.43,34.92 LED43.C
  Bottom 0.406: U$6.8 137.85,34.02 138.43,34.61 v138.43,34.92
N$54  (via drill 0.61 pad 1.27)
  Top 0.406: LED44.C v141.6,34.92
  Bottom 0.406: U$6.9 142.19,34.02 141.6,34.61 v141.6,34.92
N$55  (via drill 0.61 pad 1.27)
  Top 0.406: v144.78,34.92 LED45.C
  Bottom 0.406: U$6.10 144.18,33.38 144.78,33.97 v144.78,34.92
N$56  (via drill 0.61 pad 1.27)
  Top 0.406: v147.95,34.92 LED46.C
  Bottom 0.406: U$6.11 147.23,32.73 147.95,33.45 v147.95,34.92
N$57  (via drill 0.61 pad 1.27)
  Top 0.406: v151.13,34.92 LED47.C
  Bottom 0.406: U$6.12 149.75,32.07 151.13,33.45 v151.13,34.92
N$58
  Bottom 0.254: U$6.15 145.55,30.12 R6.2
N$59
  Bottom 0.254: U$5.14 125.44,30.77 126.08,30.12 U$6.2
N$60
  Bottom 0.254: 15.45,40.42 JP1.1 15.66,40.42 R7.1
  Bottom 0.813: IC2.2 12.27,46.56 12.06,46.35 10.79,46.35 C12.A
  Bottom 1.016: IC2.2 15.04,46.56 15.24,46.35 15.24,41.91 15.88,41.27 JP1.1
N$61
  Bottom 0.254: R7.2 12.06,43.66 IC2.1
N$80  (via drill 0.36)
  Top 0.254: C2.1 v11.43,7.62
  Top 0.305: C14.1 C2.1
  Bottom 0.254: v11.43,7.62 C2.1 9.84,7.35 IC1.63
N$81  (via drill 0.36)
  Top 0.254: U$7.2 23.13,9.89 v23.49,9.52
  Bottom 0.254: R9.1 20.95,10.79 22.23,9.52 v23.49,9.52 | v23.49,9.52 24.13,10.16 24.13,12.01 U$9.2 | IC1.28 19.29,18.65 20.32,19.68 25.4,19.68 26.43,18.65 26.67,18.41 26.67,9.52 26.03,8.89 24.13,8.89 v23.49,9.52
SCK  (via drill 0.36)
  Top 0.254: v12.7,19.37 13.02,19.05 SCK.TP
  Bottom 0.254: U$6.3 128.61,30.77 127,32.38 127,35.56 126.36,36.2 115.57,36.2 114.94,35.56 114.94,33.02 112.69,30.77 U$5.3 102.57,30.77 101.6,31.75 101.6,35.56 100.97,36.2 90.17,36.2 89.53,35.56 89.53,32.38 87.93,30.77 U$4.3 76.54,30.77 76.2,31.11 76.2,35.56 75.56,36.2 64.77,36.2 64.13,35.56 64.13,32.38 62.52,30.77 U$3.3 51.14,30.77 50.8,31.11 50.8,35.56 50.16,36.2 39.37,36.2 38.73,35.56 38.73,32.38 37.12,30.77 U$2.3 26.38,30.77 25.4,31.75 25.4,35.56 24.77,36.2 13.97,36.2 13.34,35.56 13.34,31.11 12.99,30.77 U$1.3 8.55,30.77 6.98,29.21 6.98,25.4 8.26,24.13 11.75,24.13 12.34,23.53 IC1.18 12.34,19.72 v12.7,19.37
TCK
  Bottom 0.254: IC1.21 13.84,24.95 14.29,25.4 23.81,25.4 24.13,25.08 PROG.4
TDI
  Bottom 0.254: IC1.24 15.34,23.6 15.88,24.13 21.27,24.13 21.59,23.81 PROG.8
TDO
  Bottom 0.254: IC1.23 14.84,24.37 15.24,24.76 22.54,24.76 22.86,24.45 PROG.6
TMS
  Bottom 0.254: IC1.20 13.34,25.41 13.97,26.03 25.08,26.03 25.4,25.72 PROG.2
VCC  (via drill 0.36, 0.6, 1.4)
  Top 0.254: U$7.1 23.13,13.06 v22.23,13.97
  Top 0.305: C11.A 6.85,21.4 7.3,20.95 7.3,20.37 C15.1 | C15.1 C16.1 C17.1 | v3.81,17.78 5.71,17.78 6.03,17.46 6.03,16.83 6.35,16.51 | C17.1 7.35,15.19 7.62,14.92 9.52,14.92 | C17.1 C15.1 | 9.52,14.92 11.43,14.92 12.06,14.29 14.29,14.29 v16.51,16.51 17.14,17.14 C5.1 | 11.43,13.65 v11.43,11.43 | 11.43,13.65 | 6.35,16.51 C17.1 | v6.03,15.24 6.03,16.19 6.35,16.51 | 11.43,13.65 10.32,14.76 9.68,14.76 9.52,14.92
  Top 0.406: v1.9,26.67 LED0.A | 5.08,26.67 LED1.A | 8.26,27.3 LED2.A | 11.43,27.3 LED3.A | 14.6,27.3 LED4.A | 17.78,27.3 LED5.A | 20.95,27.3 LED6.A | 24.13,27.3 LED7.A | 27.3,27.3 LED8.A | 30.48,27.3 LED9.A | 33.66,27.3 LED10.A | 36.83,27.3 LED11.A | 40.01,26.67 LED12.A | 43.18,26.67 LED13.A | 46.35,26.67 LED14.A | 49.53,26.67 LED15.A | 52.71,26.67 LED16.A | 55.88,26.67 LED17.A | 59.05,26.67 LED18.A | 62.23,26.67 LED19.A | 65.41,26.67 LED20.A | 68.58,26.67 68.58,27.3 | 68.58,27.3 LED21.A | 71.75,26.67 LED22.A | 74.93,26.67 LED23.A | 78.1,26.67 LED24.A | 81.28,26.67 LED25.A | 84.46,26.67 LED26.A | 87.63,26.67 LED27.A | 90.81,26.67 LED28.A | 93.98,26.67 LED29.A | 97.16,26.67 LED30.A | 100.33,26.67 LED31.A | 103.5,26.67 LED32.A | 106.68,26.67 LED33.A | 109.85,26.67 LED34.A | 113.03,26.67 LED35.A | 116.2,26.67 LED36.A | 119.38,26.67 LED37.A | 122.55,26.67 LED38.A | 125.73,26.67 LED39.A | 128.91,26.67 LED40.A | 132.08,26.67 LED41.A | 135.25,26.67 LED42.A | 138.43,26.67 LED43.A | 141.6,26.67 LED44.A | 144.78,26.67 LED45.A | 147.95,26.67 LED46.A | 151.13,26.67 LED47.A | v10.16,26.03 10.16,26.99 9.84,27.3 | 26.03,27.3 v26.03,27.94 | 51.43,26.67 v51.43,27.3 | 76.84,26.67 v76.84,27.3 | 102.23,26.67 v102.23,27.3 | 127.63,26.67 v127.63,27.3 | 16.51,27.3 v16.51,27.94 | 92.71,26.67 v92.71,27.3 | 118.11,26.67 v118.11,27.3 | 143.51,26.67 v143.51,27.3 | 41.91,26.67 v41.91,27.3 | 68.58,27.3 v67.94,27.3
  Top 0.61: v1.9,26.67 1.27,26.03 1.27,23.49 2.22,22.54 C11.A
  Top 1.27: v1.9,26.67 5.08,26.67 6.98,26.67 7.62,27.3 8.26,27.3 9.84,27.3 11.43,27.3 14.6,27.3 16.51,27.3 17.78,27.3 20.95,27.3 24.13,27.3 26.03,27.3 27.3,27.3 30.48,27.3 33.66,27.3 36.83,27.3 37.46,26.67 40.01,26.67 41.91,26.67 43.18,26.67 46.35,26.67 49.53,26.67 51.43,26.67 52.71,26.67 55.88,26.67 59.05,26.67 62.23,26.67 65.41,26.67 68.58,26.67 71.75,26.67 74.93,26.67 76.84,26.67 78.1,26.67 81.28,26.67 84.46,26.67 87.63,26.67 90.81,26.67 92.71,26.67 93.98,26.67 97.16,26.67 100.33,26.67 102.23,26.67 103.5,26.67 106.68,26.67 109.85,26.67 113.03,26.67 116.2,26.67 118.11,26.67 119.38,26.67 122.55,26.67 125.73,26.67 127.63,26.67 128.91,26.67 132.08,26.67 135.25,26.67 138.43,26.67 141.6,26.67 143.51,26.67 144.78,26.67 147.95,26.67 151.13,26.67
  Bottom 0.254: IC1.65 8.84,4.71 8.57,4.44 2.54,4.44 0.63,6.35 0.63,13.33 0.95,13.65 IC1.88 2.86,13.65 3.17,13.97 3.17,17.14 v3.81,17.78 | 20.95,13.33 R9.2 21.33,12.91 U$9.1 | 22.01,13.97 v22.23,13.97 24.77,13.97 25.4,14.6 PROG.1 | 1.27,56.52 4.44,56.52 | IC1.37 16.96,14.15 16.51,14.6 10.48,14.6 9.21,15.87 6.67,15.87 v6.03,15.24 | v16.51,16.51 16.51,19.05 17.14,19.68 17.86,19.68 IC1.26
  Bottom 0.305: R9.2 22.01,13.97 | 20.95,13.33 20.95,12.7 20.32,12.7 19.69,12.06 19.69,6.35 19.05,5.71 17.78,5.71 16.51,6.98 15.88,6.98 v11.43,11.43
  Bottom 0.406: C4.A 9.39,26.8 v10.16,26.03 | C6.A 26.67,28.57 v26.03,27.94 | C7.A 52.71,28.57 v51.43,27.3 | C8.A 78.1,28.57 v76.84,27.3 | C9.A 103.5,28.57 v102.23,27.3 | C10.A 128.91,28.57 v127.63,27.3 | U$1.16 15.92,28.53 v16.51,27.94 | U$4.16 92.12,27.9 v92.71,27.3 | U$5.16 117.52,27.9 v118.11,27.3 | U$6.16 142.92,27.9 v143.51,27.3 | U$2.16 41.32,27.9 v41.91,27.3 | U$3.16 67.04,29.47 67.94,28.57 v67.94,27.3
  Bottom 0.813: IC2.4 11.95,49.96 10.8,51.12 9.84,51.12 C3.A
  Bottom 1.016: IC2.4 15.04,49.96 15.24,50.16 15.24,55.88 14.6,56.52 1.27,56.52 0.95,56.2 0.95,27.62 v1.9,26.67
VCCD  (via drill 0.36)
  Top 0.254: C1.1 14.46,12.12 v13.92,12.65
  Top 0.305: C1.1 C13.1
  Bottom 0.254: IC1.86 13.34,12.65 v13.92,12.65 14.42,13.15 IC1.39
XRES
  Bottom 0.254: PROG.10 20.32,20.95 20,20.64 14.92,20.64 14.6,20.32 14.6,17.46 13.65,16.51 8.89,16.51 8.57,16.83 8.57,19.68 8.89,20 10.48,20 10.84,20.37 IC1.15

### Text on the board
bNames: XRES | TDI | TDO | TCK | TMS